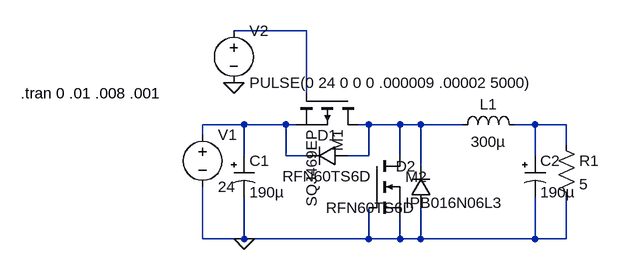
[diagram p0: schematic bi-directional-conv.asc]
bi-directional-conv.asc, the LTspice schematic file:
Version 4
SHEET 1 976 680
WIRE 368 80 256 80
WIRE 368 176 368 80
WIRE 272 224 208 224
WIRE 336 224 272 224
WIRE 352 224 336 224
WIRE 464 224 448 224
WIRE 512 224 464 224
WIRE 544 224 512 224
WIRE 608 224 544 224
WIRE 720 224 688 224
WIRE 768 224 720 224
WIRE 208 240 208 224
WIRE 768 256 768 224
WIRE 272 272 272 224
WIRE 336 272 336 224
WIRE 368 272 336 272
WIRE 464 272 464 224
WIRE 464 272 432 272
WIRE 512 272 512 224
WIRE 720 272 720 224
WIRE 544 288 544 224
WIRE 208 400 208 320
WIRE 272 400 272 336
WIRE 272 400 208 400
WIRE 464 400 464 352
WIRE 464 400 272 400
WIRE 512 400 512 368
WIRE 512 400 464 400
WIRE 544 400 544 352
WIRE 544 400 512 400
WIRE 720 400 720 336
WIRE 720 400 544 400
WIRE 768 400 768 336
WIRE 768 400 720 400
FLAG 272 400 0
FLAG 256 160 0
SYMBOL voltage 208 224 R0
SYMATTR InstName V1
SYMATTR Value 24
SYMBOL pmos 448 176 R90
SYMATTR InstName M1
SYMATTR Value SQJ469EP
SYMBOL ind 592 240 R270
WINDOW 0 32 56 VTop 2
WINDOW 3 5 56 VBottom 2
SYMATTR InstName L1
SYMATTR Value 300µ
SYMATTR SpiceLine Ipk=6.3 Rser=141.9m Rpar=61.23K Cpar=0 mfg="   ---" pn="   ---"
SYMBOL voltage 256 64 R0
SYMATTR InstName V2
SYMATTR Value PULSE(0 24 0 0 0 .000009 .00002 5000)
SYMBOL diode 432 256 R90
WINDOW 0 0 32 VBottom 2
WINDOW 3 32 32 VTop 2
SYMATTR InstName D1
SYMATTR Value RFN60TS6D
SYMBOL res 752 240 R0
SYMATTR InstName R1
SYMATTR Value 5
SYMBOL polcap 256 272 R0
WINDOW 3 24 56 Left 2
SYMATTR Value 190µ
SYMATTR InstName C1
SYMATTR Description Capacitor
SYMATTR Type cap
SYMATTR SpiceLine Rser=60m Lser=0 mfg="   ---" pn="   ---" type="   ---"
SYMBOL nmos 464 272 R0
SYMATTR InstName M2
SYMATTR Value IPB016N06L3
SYMBOL diode 560 352 R180
WINDOW 0 24 64 Left 2
WINDOW 3 24 0 Left 2
SYMATTR InstName D2
SYMATTR Value RFN60TS6D
SYMBOL polcap 704 272 R0
WINDOW 3 24 56 Left 2
SYMATTR Value 190µ
SYMATTR InstName C2
SYMATTR Description Capacitor
SYMATTR Type cap
SYMATTR SpiceLine Rser=60m Lser=0 mfg="   ---" pn="   ---" type="   ---"
TEXT -72 176 Left 2 !.tran 0 .01 .008 .001

The netlist it stands for:
* bi-directional-conv.asc
V1 N002 0 24
M1 N003 N001 N002 N002 SQJ469EP
L1 N003 N004 300µ Ipk=6.3 Rser=141.9m Rpar=61.23K Cpar=0 mfg="   ---" pn="   ---"
V2 N001 0 PULSE(0 24 0 0 0 .000009 .00002 5000)
D1 N003 N002 RFN60TS6D
R1 N004 0 5
C1 N002 0 190µ Rser=60m Lser=0 mfg="   ---" pn="   ---" type="   ---"
M2 N003 0 0 0 IPB016N06L3
D2 0 N003 RFN60TS6D
C2 N004 0 190µ Rser=60m Lser=0 mfg="   ---" pn="   ---" type="   ---"
.model D D
.lib standard.dio
.model NMOS NMOS
.model PMOS PMOS
.lib standard.mos
.tran 0 .01 .008 .001
.backanno
.end